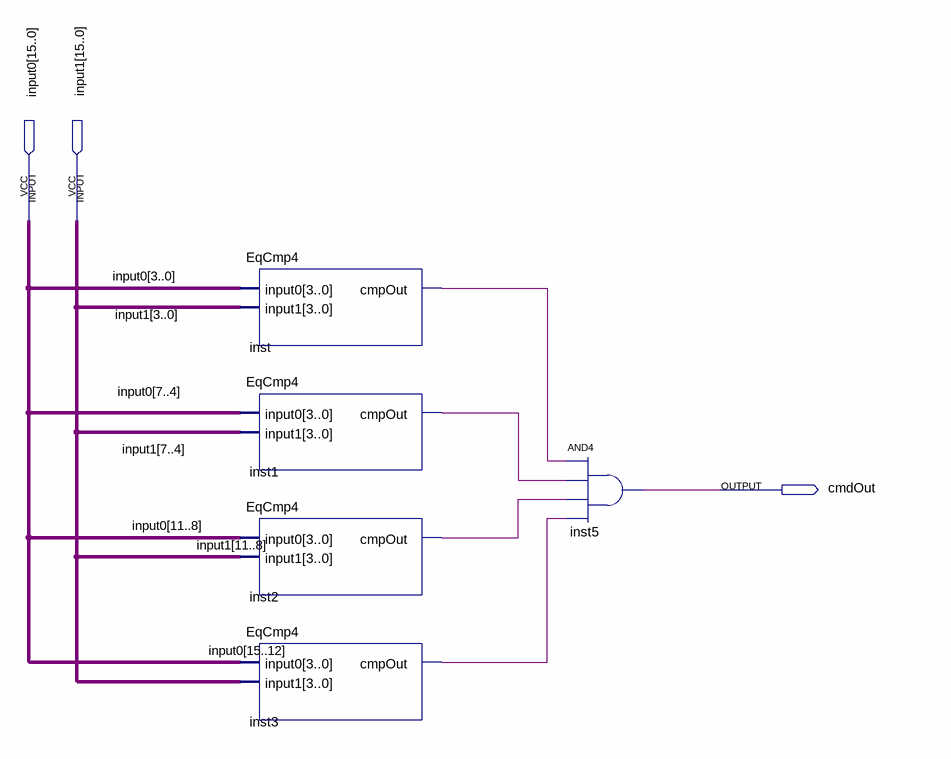
[diagram p0: schematic sheet]
// Quartus schematic EqCmp16.bdf as structural Verilog: 5 symbols, 3 pins
module EqCmp16 (
  input  [15:0] input0,
  input  [15:0] input1,
  output cmdOut
);

  wire inst1_cmpout, inst2_cmpout, inst3_cmpout, inst_cmpout;

  EqCmp4 inst (.input0(input0[3:0]), .input1(input1[3:0]), .cmpOut(inst_cmpout));
  EqCmp4 inst1 (.input0(input0[7:4]), .input1(input1[7:4]), .cmpOut(inst1_cmpout));
  EqCmp4 inst2 (.input0(input0[11:8]), .input1(input1[11:8]), .cmpOut(inst2_cmpout));
  EqCmp4 inst3 (.input0(input0[15:12]), .input1(input1), .cmpOut(inst3_cmpout));
  and inst5 (cmdOut, inst_cmpout, inst1_cmpout, inst2_cmpout, inst3_cmpout);
endmodule
